# EAGLE design target-panel (EAGLE 5.07)
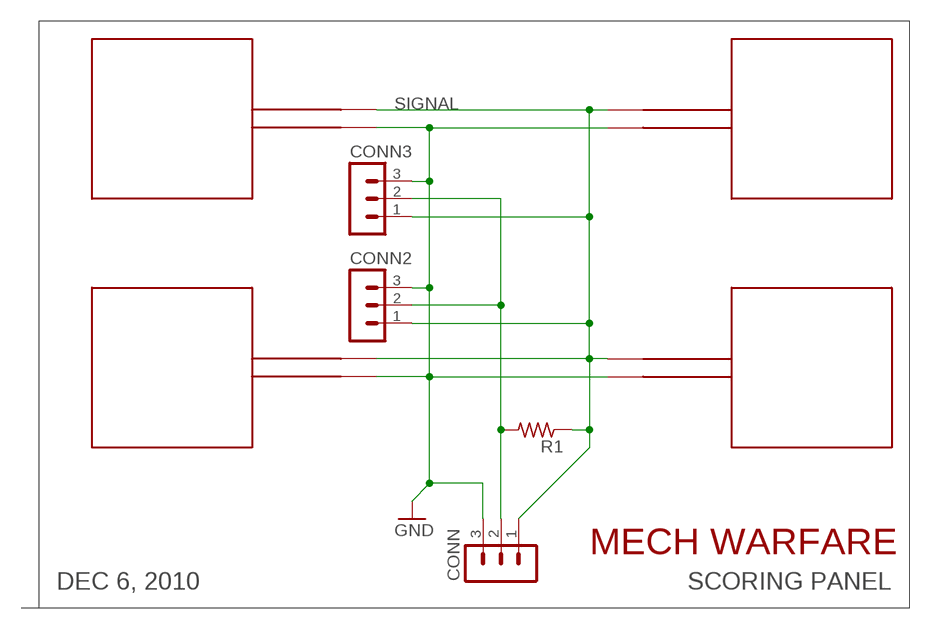
[diagram p0: schematic, sheet 1]

## Parts
CONN  MA03-1  [MA03-1]
CONN2  MA03-1  [MA03-1]
CONN3  MA03-1  [MA03-1]
R1  R-US_0207/10  [0207/10]
U$1  FSR  [1X2]
U$2  FSR  [1X2]
U$3  FSR  [1X2]
U$4  FSR  [1X2]

## Nets
GND: CONN2.3 CONN3.3 CONN.3 U$1.P$2 U$2.P$2 U$3.P$1 U$4.P$1
N$2: CONN2.2 CONN3.2 CONN.2 R1.2
SIGNAL: CONN2.1 CONN3.1 CONN.1 R1.1 U$1.P$1 U$2.P$1 U$3.P$2 U$4.P$2

## Notes on the sheet
- MECH WARFARE
- SCORING PANEL
- DEC 6, 2010

## Library data of the parts
CONN CONN2 CONN3 = con-lstb:MA03-1: PIN HEADER
R1 = rcl:R-US_: RESISTOR, American symbol
U$1-U$4 = robots:FSR

## Board
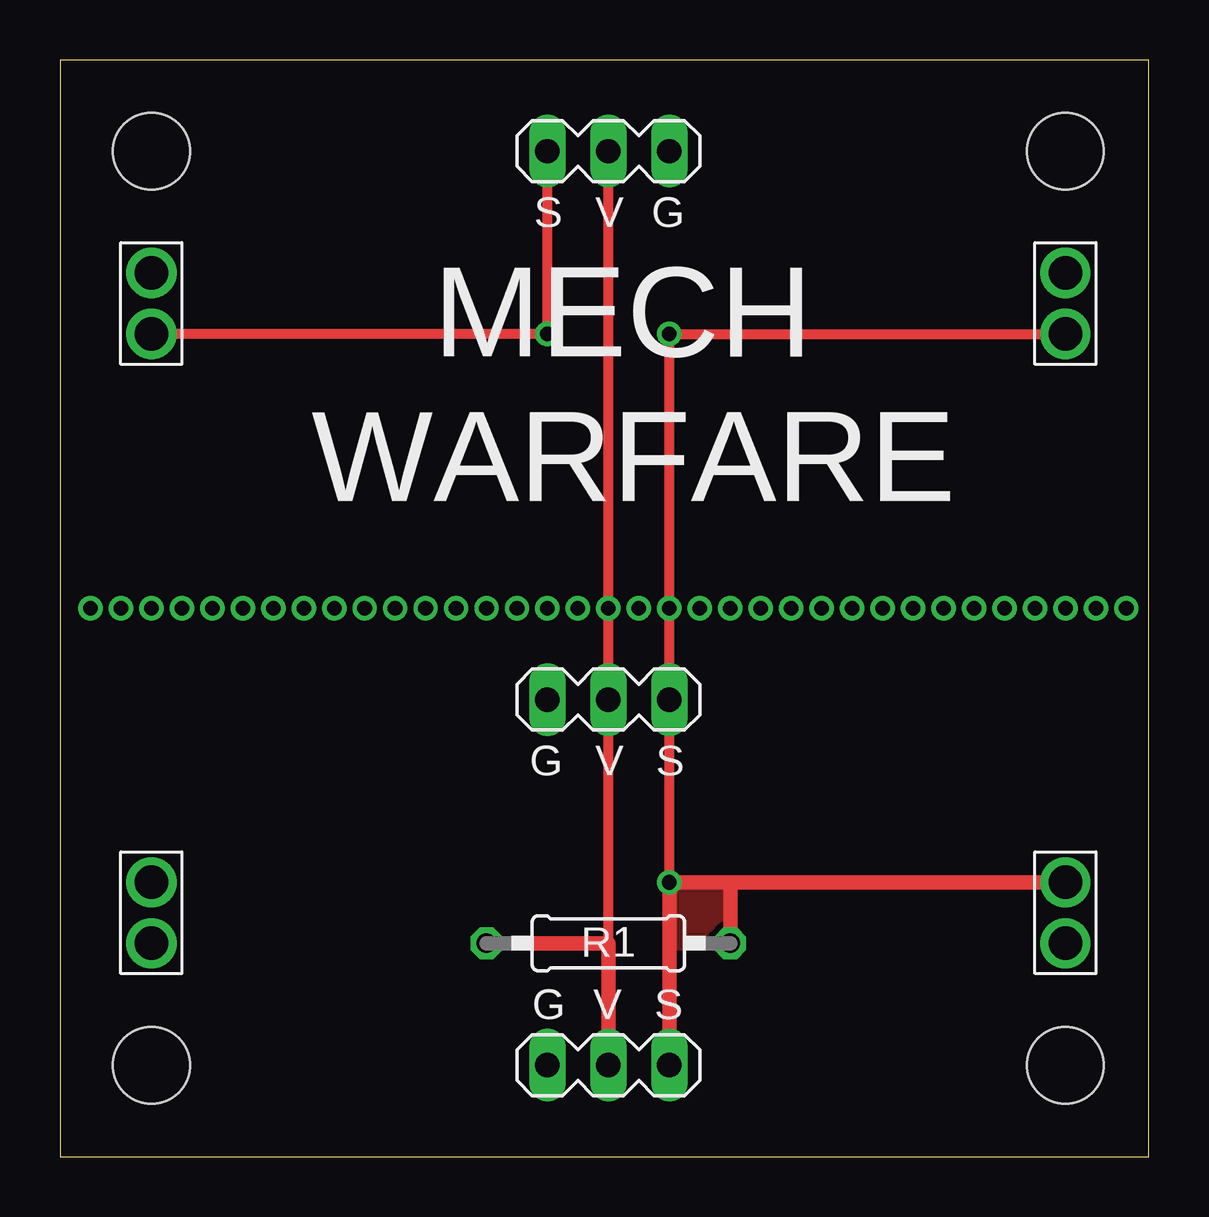
[diagram p1: board, top side]
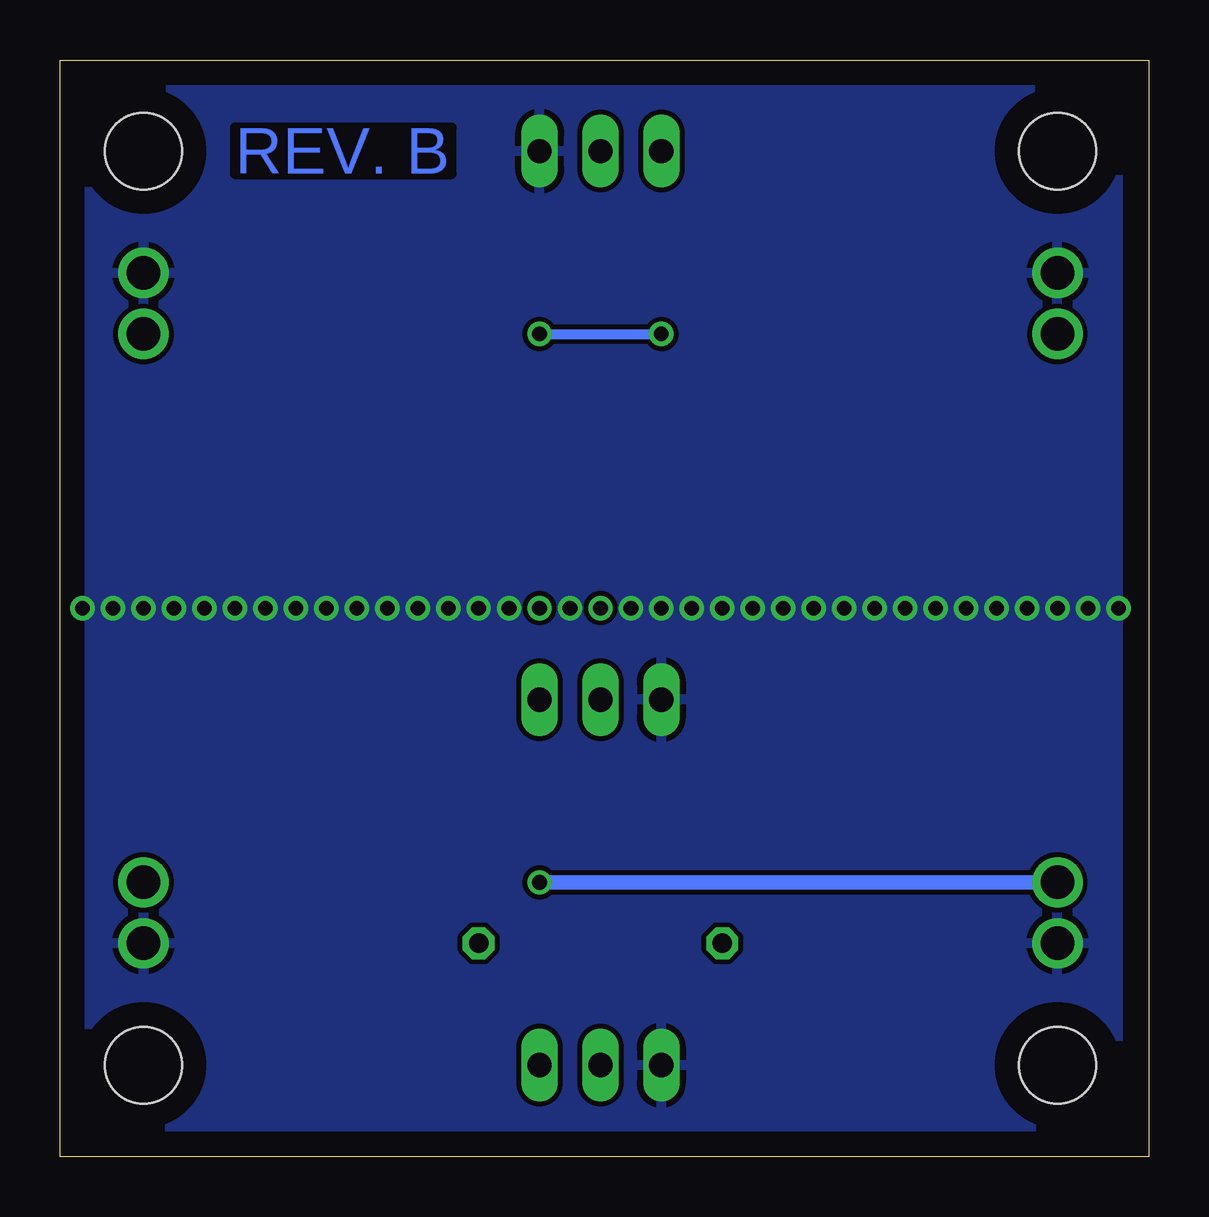
[diagram p2: board, bottom side, seen from below]

Size 45.39 x 45.71 mm. Coordinates in mm from the lower left corner, seen from the top.
Outline: 0,0 45.39,0 45.39,45.71 0,45.71 0,0
Copper layers (1*16): Top 0.035mm / dielectric 1.5mm / Bottom 0.035mm
Design rules "default *": minimum track width 10mil, minimum drill 24mil, track to track 8mil, track to pad 8mil, pad to pad 8mil, via to via 8mil, smd to smd 8mil, copper to edge 40mil, drill to drill 8mil, minimum pad ring 10mil, minimum via ring 8mil, stop-mask expansion 4mil, vias tented up to drill 24mil, thermal gap 10mil
Holes 3.2 mm at 3.81,41.91 3.81,3.81 41.91,3.81 41.91,41.91

### Footprints (pad centres in the part's own frame; a part is rotated, then mirrored left to right if it is on the bottom)
MA03-1 = drill 1.016 long: 1 -2.54,0; 2 0,0; 3 2.54,0
0207/10 = drill 0.813 octagon: 1 -5.08,0; 2 5.08,0
1X2 = drill 1.397 round: P$1 0,0; P$2 2.54,0

### Placement (x,y rotation side)
CONN  22.86,3.81 180 top
CONN2  22.86,19.05 180 top
CONN3  22.86,41.91 0 top
R1  22.86,8.89 180 top
U$1  41.91,11.43 270 top
U$2  3.81,11.43 270 top
U$3  41.91,36.83 270 top
U$4  3.81,36.83 270 top

### Tracks (layer width: path | path; a pad name or v marks a point on that pad's centre or on a via)
GND  (via drill 0.61)
  other vias: 1.27,22.86 2.54,22.86 3.81,22.86 5.08,22.86 6.35,22.86 7.62,22.86 8.89,22.86 10.16,22.86 11.43,22.86 12.7,22.86 13.97,22.86 15.24,22.86 16.51,22.86 17.78,22.86 19.05,22.86 20.32,22.86 21.59,22.86 24.13,22.86 26.67,22.86 27.94,22.86 29.21,22.86 30.48,22.86 31.75,22.86 33.02,22.86 34.29,22.86 35.56,22.86 36.83,22.86 38.1,22.86 39.37,22.86 40.64,22.86 41.91,22.86 43.18,22.86 44.45,22.86
  pour Bottom: 1.27,44.45 44.45,44.45 44.45,1.27 1.27,1.27
N$2  (via drill 0.61)
  Top 0.406: 22.86,8.89 CONN2.2 v22.86,22.86 CONN3.2
  Top 0.61: CONN.2 22.86,8.89 R1.2
SIGNAL  (via drill 0.61)
  Top 0.406: U$4.P$2 v20.32,34.29 CONN3.1 | U$3.P$2 v25.4,34.29 v25.4,22.86 CONN2.1 v25.4,11.43
  Top 0.61: 27.94,11.43 U$1.P$1 | 27.94,11.43 v25.4,11.43 CONN.1 | 27.94,11.43 R1.1
  Bottom 0.406: v25.4,34.29 v20.32,34.29
  Bottom 0.61: U$2.P$1 v25.4,11.43
  pour Top: 27.94,8.89 25.4,8.89 25.4,11.43 27.94,11.43

### Text on the board
Bottom: REV. B
tNames: S | V | G | MECH | WARFARE | G | V | S | G | V | S